# EAGLE design 309_rs232c (EAGLE 9.6.2)
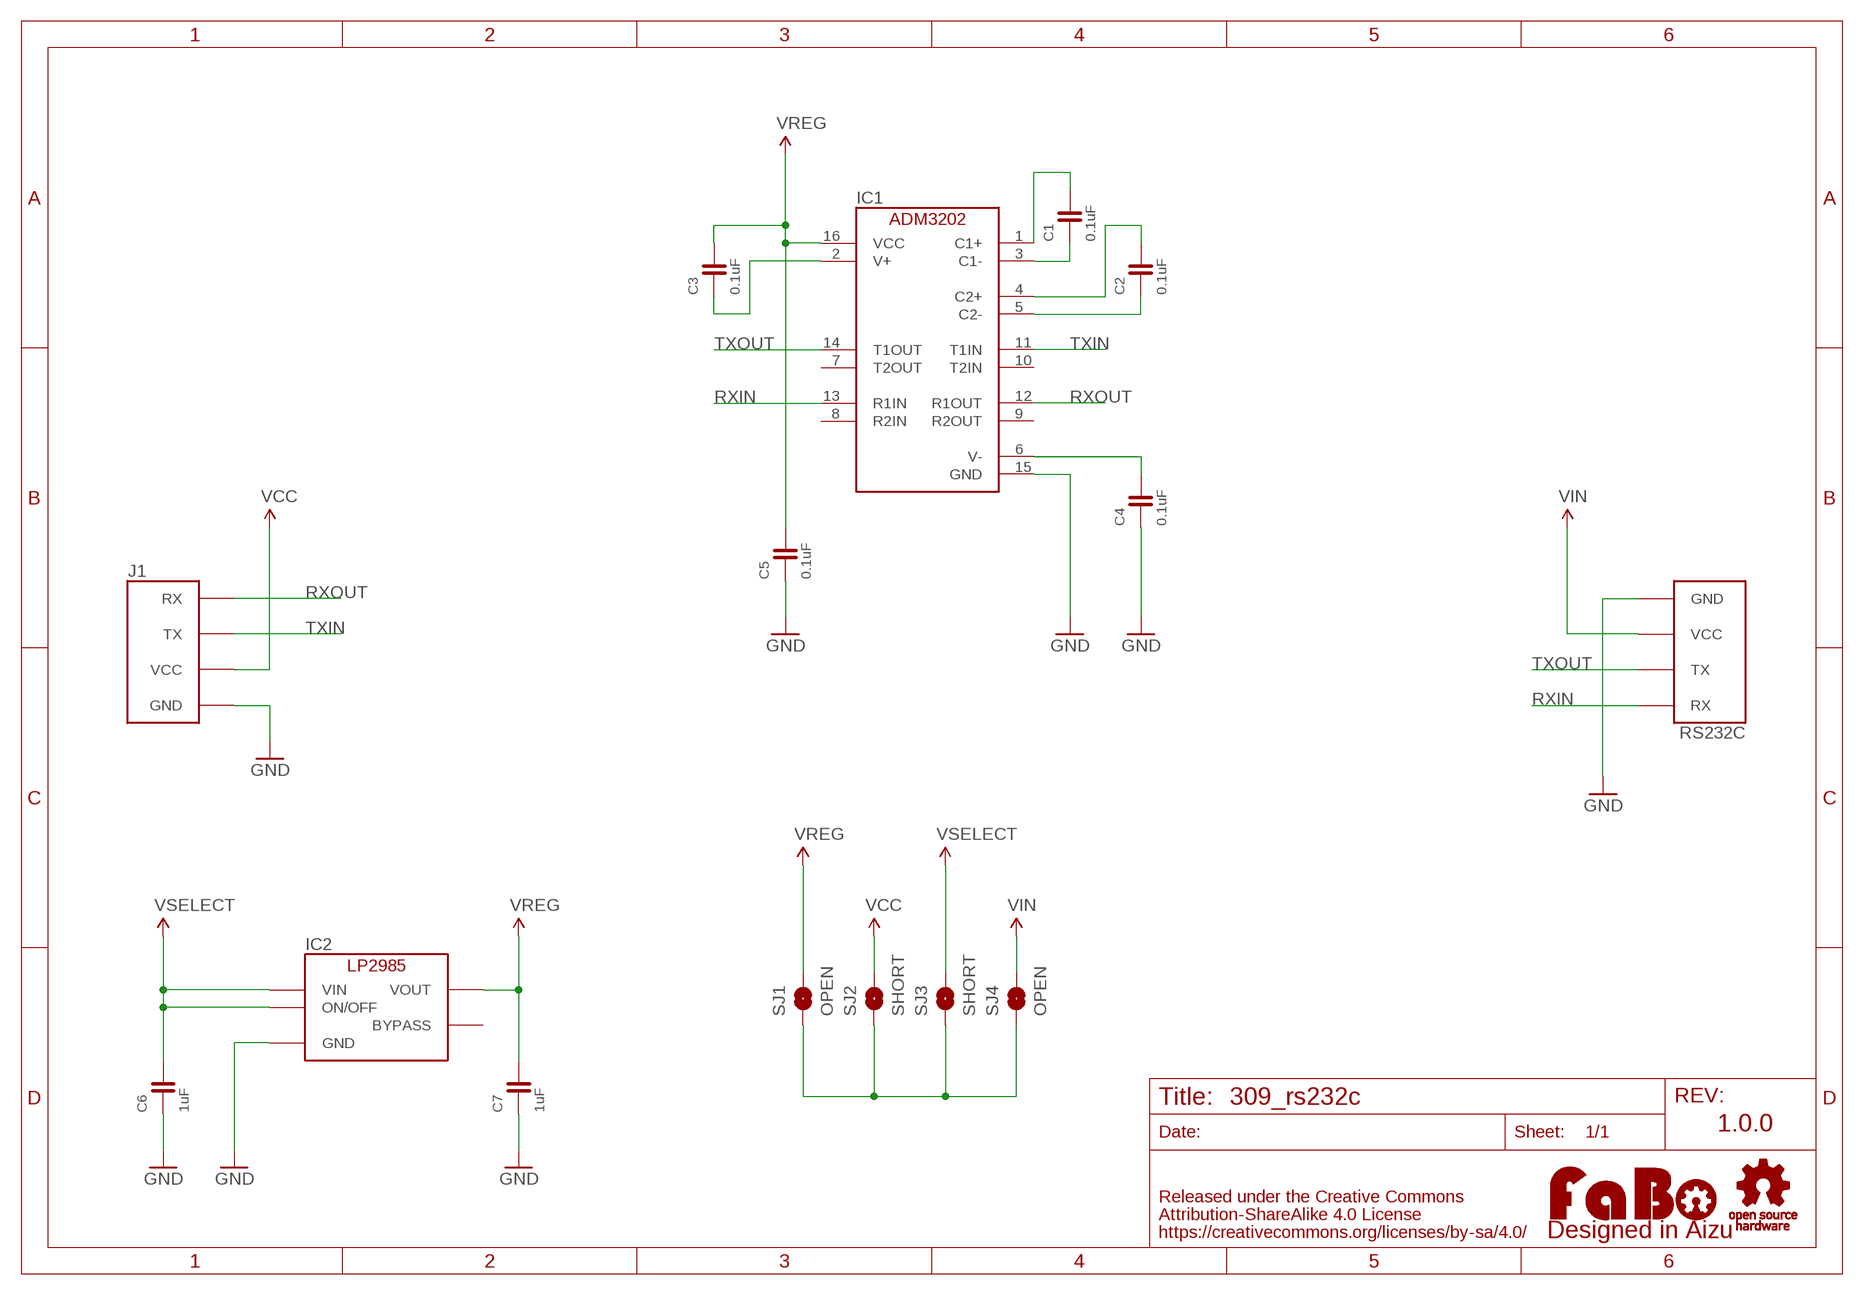
[diagram p0: schematic, sheet 1]

## Parts
C1  0.1uF  CAPACITOR-0603_NARROW  [0603-NARROW]
C2  0.1uF  CAPACITOR-0603_NARROW  [0603-NARROW]
C3  0.1uF  CAPACITOR-0603_NARROW  [0603-NARROW]
C4  0.1uF  CAPACITOR-0603_NARROW  [0603-NARROW]
C5  0.1uF  CAPACITOR-0603_NARROW  [0603-NARROW]
C6  1uF  CAPACITOR-0603_NARROW  [0603-NARROW]
C7  1uF  CAPACITOR-0603_NARROW  [0603-NARROW]
IC1  ADM3202ARU  [TSSOP-16]
IC2  LP2985-33DBV  [SOT-23-5]
J1  FABO_BRICK_SERIAL  [FABO_BRICK_SERIAL]
LOGO1  LOGO_FABO-M_BOTTOM  [LOGO_FABO_M_BOTTOM]
RS232C  FABO_BRICK_SERIAL-S04B-PASK-2_LONG  [FABO_BRICK_SERIAL_S04B-PASK-2_LONG]
SJ1  OPEN  SMD-JUMPER-2-OPEN  [SMD-JUMPER-2-OPEN]
SJ2  SHORT  SMD-JUMPER-2-SHORT  [SMD-JUMPER-2-SHORT]
SJ3  SHORT  SMD-JUMPER-2-SHORT  [SMD-JUMPER-2-SHORT]
SJ4  OPEN  SMD-JUMPER-2-OPEN  [SMD-JUMPER-2-OPEN]
U$2  LOGO_OSHW-M_BOTTOM  [LOGO_OSHW_M_BOTTOM]

## Nets
GND: C4.1 C5.1 C6.1 C7.1 IC1.15(GND) IC2.2(GND) J1.GND RS232C.GND
N$5: SJ1.2 SJ2.2 SJ3.2 SJ4.2
N$6: C1.1 IC1.3(C1-)
N$7: C1.2 IC1.1(C1+)
N$8: C2.1 IC1.5(C2-)
N$9: C2.2 IC1.4(C2+)
N$10: C3.1 IC1.2(V+)
N$12: C4.2 IC1.6(V-)
RXIN: IC1.13(R1IN) RS232C.RX
RXOUT: IC1.12(R1OUT) J1.RX
TXIN: IC1.11(T1IN) J1.TX
TXOUT: IC1.14(T1OUT) RS232C.TX
VCC: J1.VCC SJ2.1
VIN: RS232C.VCC SJ4.1
VREG: C3.2 C5.2 C7.2 IC1.16(VCC) IC2.5(VOUT) SJ1.1
VSELECT: C6.2 IC2.1(VIN) IC2.3(ON/OFF) SJ3.1
Unconnected: IC1.7(T2OUT) IC1.8(R2IN) IC1.9(R2OUT) IC1.10(T2IN) IC2.4(BYPASS)

## Notes on the sheet
- 1.0.0

## Library data of the parts
C1-C7 = FaBo-Capacitor:CAPACITOR: CAPACITOR
IC1 = FaBo-LevelTranslator:ADM3202ARU
IC2 = FaBo-Supply:LP2985: LP2985
J1 RS232C = FaBo-Template:FABO_BRICK_SERIAL: FaBo Brick Serial
LOGO1 = component:LOGO_FABO
SJ1-SJ4 = FaBo-Supply:SMD-JUMPER-2
U$2 = FaBo-etc:LOGO_OSHW

## Board
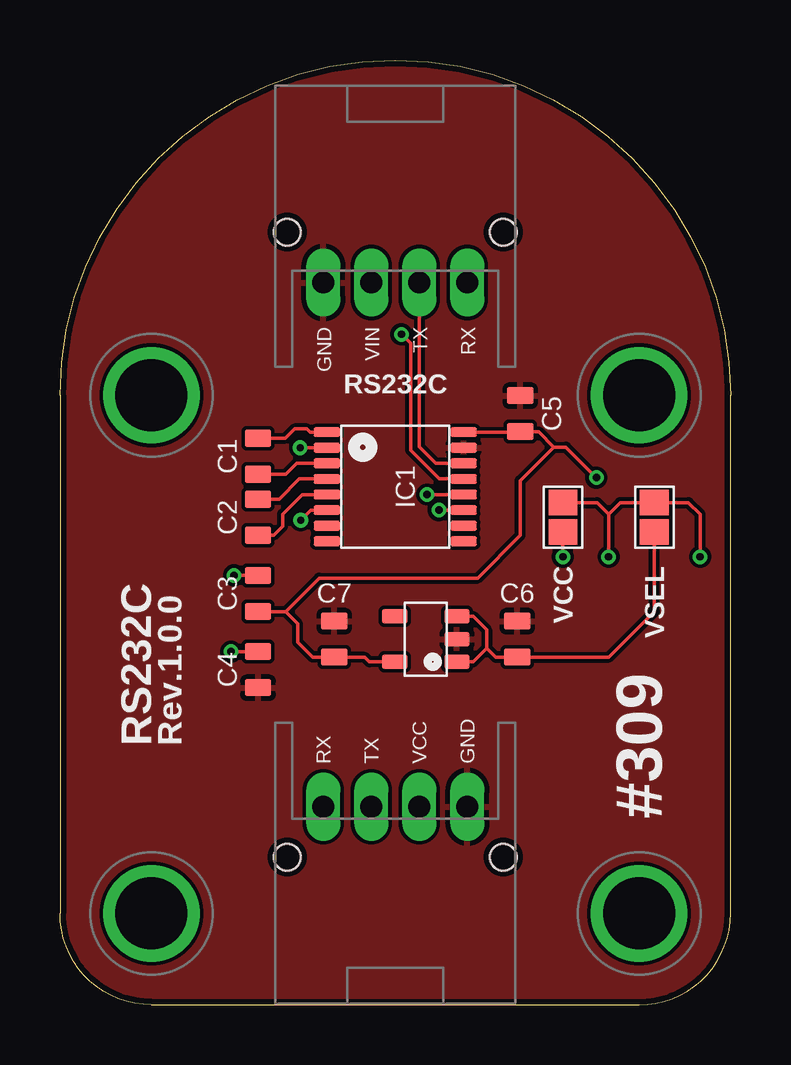
[diagram p1: board, top side]
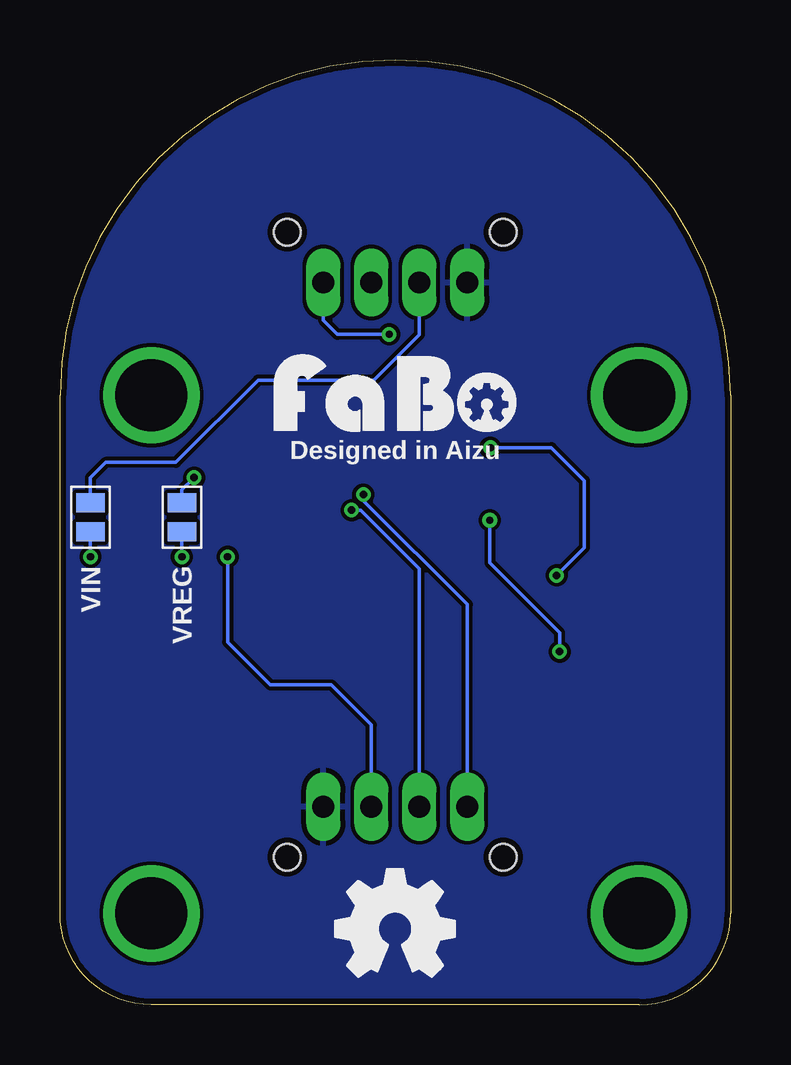
[diagram p2: board, bottom side, seen from below]

Size 27.94 x 39.37 mm. Coordinates in mm from the lower left corner, seen from the top.
Copper layers (1*16): Top 0.035mm / dielectric 1.6mm / Bottom 0.035mm
Design rules "PCBway": minimum track width 6mil, minimum drill 12mil, track to track 6mil, track to pad 6mil, pad to pad 6mil, via to via 6mil, smd to smd 6mil, copper to edge 10mil, drill to drill 10mil, minimum pad ring 10mil, minimum via ring 6mil, stop-mask expansion 2mil, vias tented up to drill 100mil, thermal gap 8mil

### Footprints (pad centres in the part's own frame; a part is rotated, then mirrored left to right if it is on the bottom)
0603-NARROW = smd 0.71 x 1.09: 1 -0.75,0; 2 0.75,0
TSSOP-16 = smd 0.4 x 1.1: 1 -2.275,-2.85; 2 -1.625,-2.85; 3 -0.975,-2.85; 4 -0.325,-2.85; 5 0.325,-2.85; 6 0.975,-2.85; 7 1.625,-2.85; 8 2.275,-2.85; 9 2.275,2.85; 10 1.625,2.85; 11 0.975,2.85; 12 0.325,2.85; 13 -0.325,2.85; 14 -0.975,2.85; 15 -1.625,2.85; 16 -2.275,2.85
SOT-23-5 = smd 0.6 x 1.05: 1 -0.95,-1.3; 2 0,-1.3; 3 0.95,-1.3; 4 0.95,1.3; 5 -0.95,1.3
FABO_BRICK_SERIAL = drill 0.9 pad 1.422 long: GND 3,-10.795; RX -3,-10.795; TX -1,-10.795; VCC 1,-10.795 | drill 3 pad 3.81: P$1 -10.16,6.35; P$2 10.16,6.35; P$3 -10.16,-15.24; P$4 10.16,-15.24 | hole 1.1: -4.5,-12.895; 4.5,-12.895
FABO_BRICK_SERIAL_S04B-PASK-2_LONG = drill 0.9 pad 1.422 long: GND -3,0; RX 3,0; TX 1,0; VCC -1,0 | hole 1.1: 4.5,2.1; -4.5,2.1
SMD-JUMPER-2-OPEN = smd 0.8 x 1.2: 1 -0.6,0; 2 0.6,0
SMD-JUMPER-2-SHORT = smd 1.067 x 1.2: 1 -0.61,0; 2 0.61,0

### Placement (x,y rotation side)
C1  8.26,22.86 90 top
C2  8.26,20.32 90 top
C3  8.26,17.14 270 top
C4  8.26,13.97 90 top
C5  19.18,24.64 270 top
C6  19.05,15.24 270 top
C7  11.43,15.24 270 top
IC1  13.97,21.59 270 top
IC2  15.24,15.24 90 top
J1  13.97,19.05 0 top
LOGO1  13.97,23.5 0 top
RS232C  13.97,30.1 0 top
SJ1  22.86,20.32 270 bottom
SJ2  20.95,20.32 90 top
SJ3  24.77,20.32 90 top
SJ4  26.67,20.32 270 bottom
U$2  13.97,3.17 0 top

### Tracks (layer width: path | path; a pad name or v marks a point on that pad's centre or on a via)
GND
  pour Bottom: 0,0 27.94,0 27.94,39.37 0,39.37
  pour Top: 0,0 27.94,0 27.94,39.37 0,39.37
N$5  (via drill 0.3)
  Top 0.152: v26.67,18.67 26.67,20.45 26.19,20.93 SJ3.2 23.34,20.93 22.86,20.45 | 22.86,18.92 v22.86,18.67 22.86,20.45 | SJ2.2 22.38,20.93 22.86,20.45
  Bottom 0.152: SJ4.2 v26.67,18.67 | SJ1.2 v22.86,18.67
N$6
  Top 0.152: IC1.3 9.87,22.57 9.41,22.11 C1.1
N$7
  Top 0.152: IC1.1 10.43,23.86 10.29,24 9.78,24 9.39,23.61 C1.2
N$8
  Top 0.152: IC1.5 10.09,21.27 9.27,20.45 9.27,19.94 8.9,19.57 C2.1
N$9
  Top 0.152: IC1.4 9.98,21.91 9.13,21.07 C2.2
N$10  (via drill 0.3)
  Top 0.152: IC1.2 v10.01,23.21 | C3.1 v7.25,17.89
  Bottom 0.152: v10.01,23.21 7.47,23.21 6.1,21.84 6.1,19.05 v7.25,17.89
N$12  (via drill 0.3)
  Top 0.152: IC1.6 10.46,20.61 v10.03,20.19 | C4.2 v7.12,14.72
  Bottom 0.152: v10.03,20.19 10.03,18.41 7.12,15.51 v7.12,14.72
RXIN  (via drill 0.3)
  Top 0.152: IC1.13 15.8,21.91 14.61,23.11 14.61,27.56 v14.22,27.94
  Bottom 0.152: v14.22,27.94 16.38,27.94 16.97,28.53 RS232C.RX
RXOUT  (via drill 0.3)
  Top 0.152: IC1.12 v15.3,21.27
  Bottom 0.152: J1.RX 10.97,16.68 15.3,21.01 v15.3,21.27
TXIN  (via drill 0.3)
  Top 0.152: IC1.11 v15.79,20.61
  Bottom 0.152: J1.TX 12.97,18.18 15.41,20.61 v15.79,20.61
TXOUT
  Top 0.152: RS232C.TX 14.97,23.26 15.66,22.57 IC1.14
VCC  (via drill 0.3)
  Top 0.152: SJ2.1 v20.95,18.67
  Bottom 0.152: J1.VCC 14.97,11.67 16.64,13.34 19.18,13.34 20.95,15.11 v20.95,18.67
VIN
  Bottom 0.152: RS232C.VCC 12.97,27.92 14.86,26.04 19.68,26.04 23.11,22.61 26.04,22.61 26.67,21.97 SJ4.1
VREG  (via drill 0.3)
  Top 0.152: IC1.16 19.15,23.86 C5.2 19.19,23.88 19.94,23.88 20.57,23.24 | IC2.5 12.89,14.29 12.7,14.48 11.44,14.48 C7.2 10.53,14.49 9.91,15.11 9.91,15.88 9.4,16.38 | 9.4,16.38 10.79,17.78 17.4,17.78 19.18,19.56 19.18,21.84 20.57,23.24 | 20.57,23.24 21.08,23.24 v22.35,21.97 | 9.4,16.38 C3.2
  Bottom 0.152: SJ1.1 22.86,21.46 v22.35,21.97
VSELECT
  Top 0.152: IC2.3 17.21,16.19 17.78,15.62 17.78,14.86 | 17.78,14.86 18.16,14.48 19.04,14.48 C6.2 22.87,14.49 24.77,16.38 SJ3.1 | IC2.1 17.21,14.29 17.78,14.86

### Text on the board
tPlace: GND | VIN | TX | RX | VCC | VSEL | RS232C | Rev.1.0.0 | #309
bPlace: Designed in Aizu | VREG | VIN